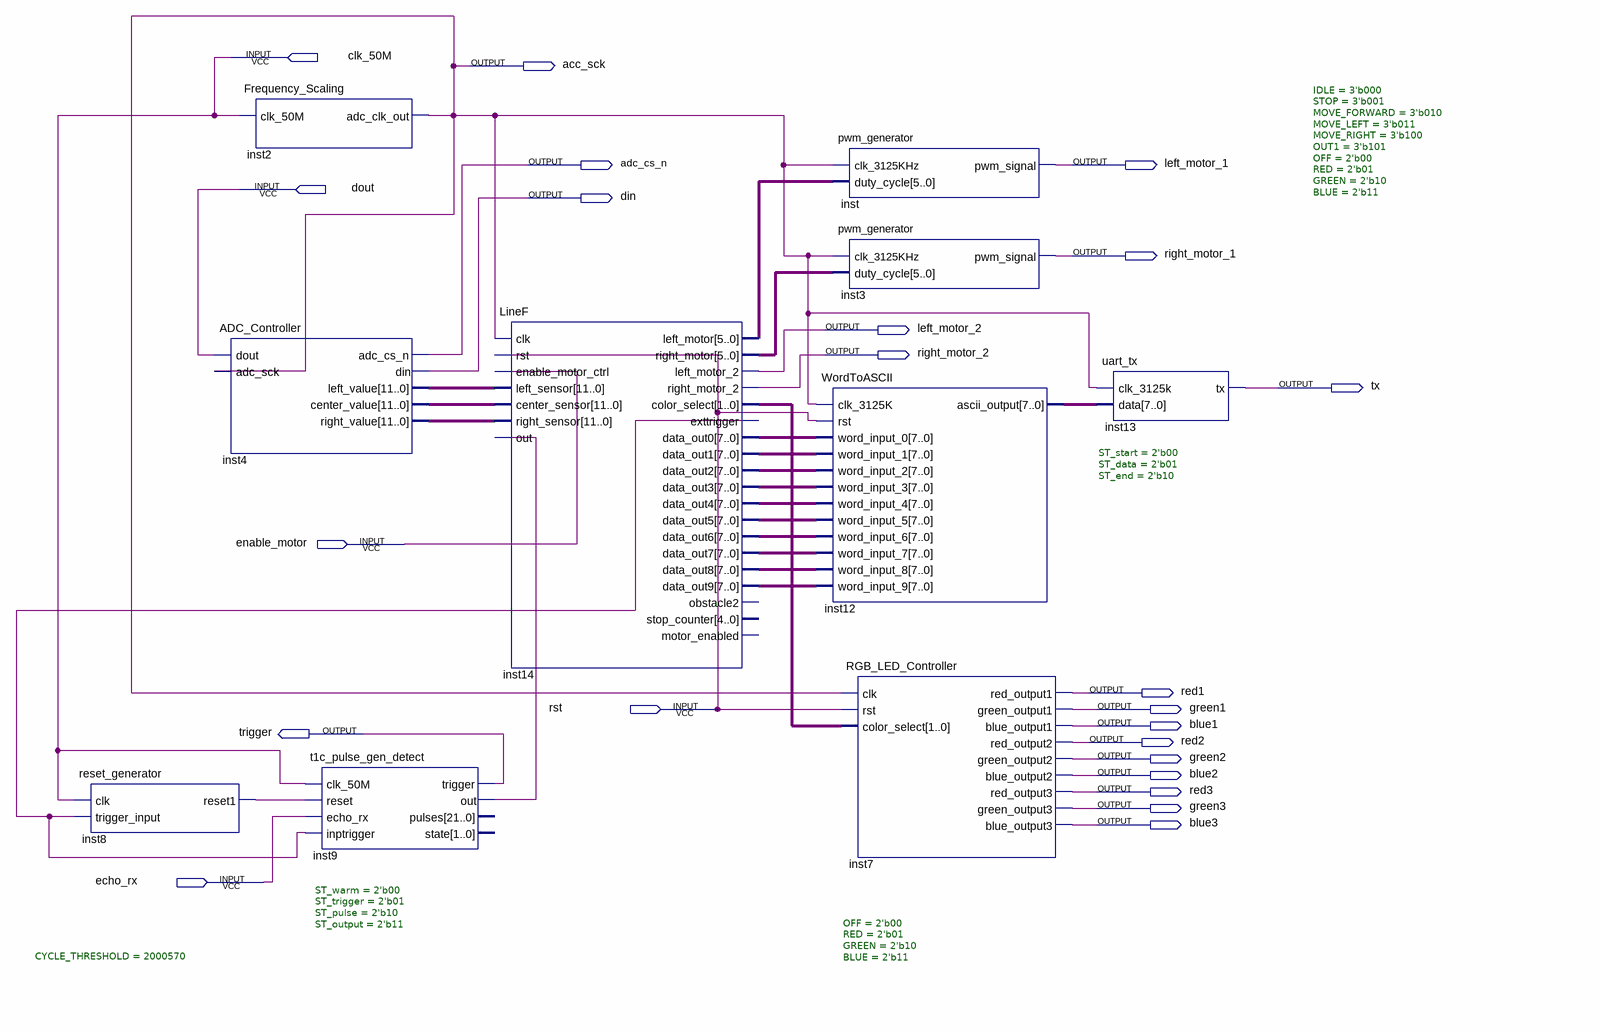
[diagram p0: schematic sheet]
// Quartus schematic motortestwithpwm.bdf as structural Verilog: 10 symbols, 23 pins
module motortestwithpwm (
  input  clk_50M,
  input  dout,
  input  enable_motor,
  input  rst,
  input  echo_rx,
  output acc_sck,
  output adc_cs_n,
  output left_motor_1,
  output din,
  output right_motor_1,
  output left_motor_2,
  output right_motor_2,
  output tx,
  output red1,
  output green1,
  output blue1,
  output trigger,
  output red2,
  output green2,
  output blue2,
  output red3,
  output green3,
  output blue3
);

  wire inst8_reset1, inst9_out, inst14_exttrigger;
  wire [1:0] inst14_color_select;
  wire [5:0] inst14_left_motor, inst14_right_motor;
  wire [7:0] inst12_ascii_output, inst14_data_out0, inst14_data_out1, inst14_data_out2, inst14_data_out3,
       inst14_data_out4, inst14_data_out5, inst14_data_out6, inst14_data_out7, inst14_data_out8,
       inst14_data_out9;
  wire [11:0] inst4_center_value, inst4_left_value, inst4_right_value;

  reset_generator #(.CYCLE_THRESHOLD(2000570)) inst8 (
    .clk(clk_50M), .trigger_input(inst14_exttrigger), .reset1(inst8_reset1));
  Frequency_Scaling inst2 (.clk_50M(clk_50M), .adc_clk_out(acc_sck));
  ADC_Controller inst4 (
    .dout(dout), .adc_sck(acc_sck), .adc_cs_n(adc_cs_n), .din(din), .left_value(inst4_left_value),
    .center_value(inst4_center_value), .right_value(inst4_right_value));
  t1c_pulse_gen_detect #(.ST_warm(2'b00), .ST_trigger(2'b01), .ST_pulse(2'b10), .ST_output(2'b11)) inst9 (
    .clk_50M(clk_50M), .reset(inst8_reset1), .echo_rx(echo_rx), .inptrigger(inst14_exttrigger),
    .trigger(trigger), .out(inst9_out));  // open: pulses, state
  LineF #(.IDLE(3'b000), .STOP(3'b001), .MOVE_FORWARD(3'b010), .MOVE_LEFT(3'b011), .MOVE_RIGHT(3'b100), .OUT1(3'b101), .OFF(2'b00), .RED(2'b01), .GREEN(2'b10), .BLUE(2'b11)) inst14 (
    .clk(acc_sck), .rst(rst), .enable_motor_ctrl(enable_motor), .left_sensor(inst4_left_value),
    .center_sensor(inst4_center_value), .right_sensor(inst4_right_value), .out(inst9_out),
    .left_motor(inst14_left_motor), .right_motor(inst14_right_motor), .left_motor_2(left_motor_2),
    .right_motor_2(right_motor_2), .color_select(inst14_color_select), .exttrigger(inst14_exttrigger),
    .data_out0(inst14_data_out0), .data_out1(inst14_data_out1), .data_out2(inst14_data_out2),
    .data_out3(inst14_data_out3), .data_out4(inst14_data_out4), .data_out5(inst14_data_out5),
    .data_out6(inst14_data_out6), .data_out7(inst14_data_out7), .data_out8(inst14_data_out8),
    .data_out9(inst14_data_out9));  // open: obstacle2, stop_counter, motor_enabled
  pwm_generator inst (.clk_3125KHz(acc_sck), .duty_cycle(inst14_left_motor), .pwm_signal(left_motor_1));
  pwm_generator inst3 (.clk_3125KHz(acc_sck), .duty_cycle(inst14_right_motor), .pwm_signal(right_motor_1));
  WordToASCII inst12 (
    .clk_3125K(acc_sck), .rst(rst), .word_input_0(inst14_data_out0), .word_input_1(inst14_data_out1),
    .word_input_2(inst14_data_out2), .word_input_3(inst14_data_out3), .word_input_4(inst14_data_out4),
    .word_input_5(inst14_data_out5), .word_input_6(inst14_data_out6), .word_input_7(inst14_data_out7),
    .word_input_8(inst14_data_out8), .word_input_9(inst14_data_out9), .ascii_output(inst12_ascii_output));
  RGB_LED_Controller #(.OFF(2'b00), .RED(2'b01), .GREEN(2'b10), .BLUE(2'b11)) inst7 (
    .clk(acc_sck), .rst(rst), .color_select(inst14_color_select), .red_output1(red1), .green_output1(green1),
    .blue_output1(blue1), .red_output2(red2), .green_output2(green2), .blue_output2(blue2),
    .red_output3(red3), .green_output3(green3), .blue_output3(blue3));
  uart_tx #(.ST_start(2'b00), .ST_data(2'b01), .ST_end(2'b10)) inst13 (
    .clk_3125k(acc_sck), .data(inst12_ascii_output), .tx(tx));
endmodule
